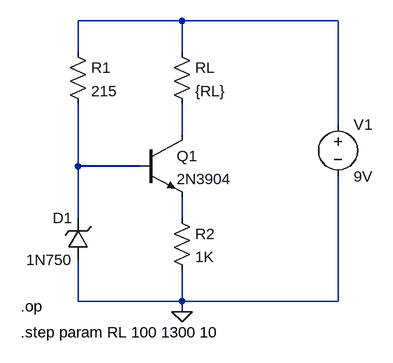
[diagram p0: schematic transistor_zener.asc]
transistor_zener.asc, the LTspice schematic file:
Version 4
SHEET 1 880 680
WIRE 288 -64 128 -64
WIRE 528 -64 288 -64
WIRE 128 -16 128 -64
WIRE 288 -16 288 -64
WIRE 528 96 528 -64
WIRE 288 112 288 64
WIRE 128 160 128 64
WIRE 224 160 128 160
WIRE 128 240 128 160
WIRE 288 240 288 208
WIRE 128 368 128 304
WIRE 288 368 288 320
WIRE 288 368 128 368
WIRE 528 368 528 176
WIRE 528 368 288 368
WIRE 288 384 288 368
FLAG 288 384 0
SYMBOL npn 224 112 R0
SYMATTR InstName Q1
SYMATTR Value 2N3904
SYMBOL res 272 -32 R0
SYMATTR InstName RL
SYMATTR Value {RL}
SYMBOL res 272 224 R0
SYMATTR InstName R2
SYMATTR Value 1K
SYMBOL res 112 -32 R0
SYMATTR InstName R1
SYMATTR Value 215
SYMBOL voltage 528 80 R0
SYMATTR InstName V1
SYMATTR Value 9V
SYMBOL zener 144 304 R180
WINDOW 0 24 64 Left 2
WINDOW 3 24 0 Left 2
SYMATTR InstName D1
SYMATTR Value 1N750
SYMATTR Description Diode
SYMATTR Type diode
TEXT 40 376 Left 2 !.op
TEXT 40 416 Left 2 !.step param RL 100 1300 10

The netlist it stands for:
* transistor_zener.asc
Q1 N002 N003 N004 0 2N3904
RL N001 N002 {RL}
R2 N004 0 1K
R1 N001 N003 215
V1 N001 0 9V
D1 0 N003 1N750
.model D D
.lib standard.dio
.model NPN NPN
.model PNP PNP
.lib standard.bjt
.op
.step param RL 100 1300 10
.backanno
.end